# EAGLE design Mabee_CO2 v1.1 (EAGLE 6.1)
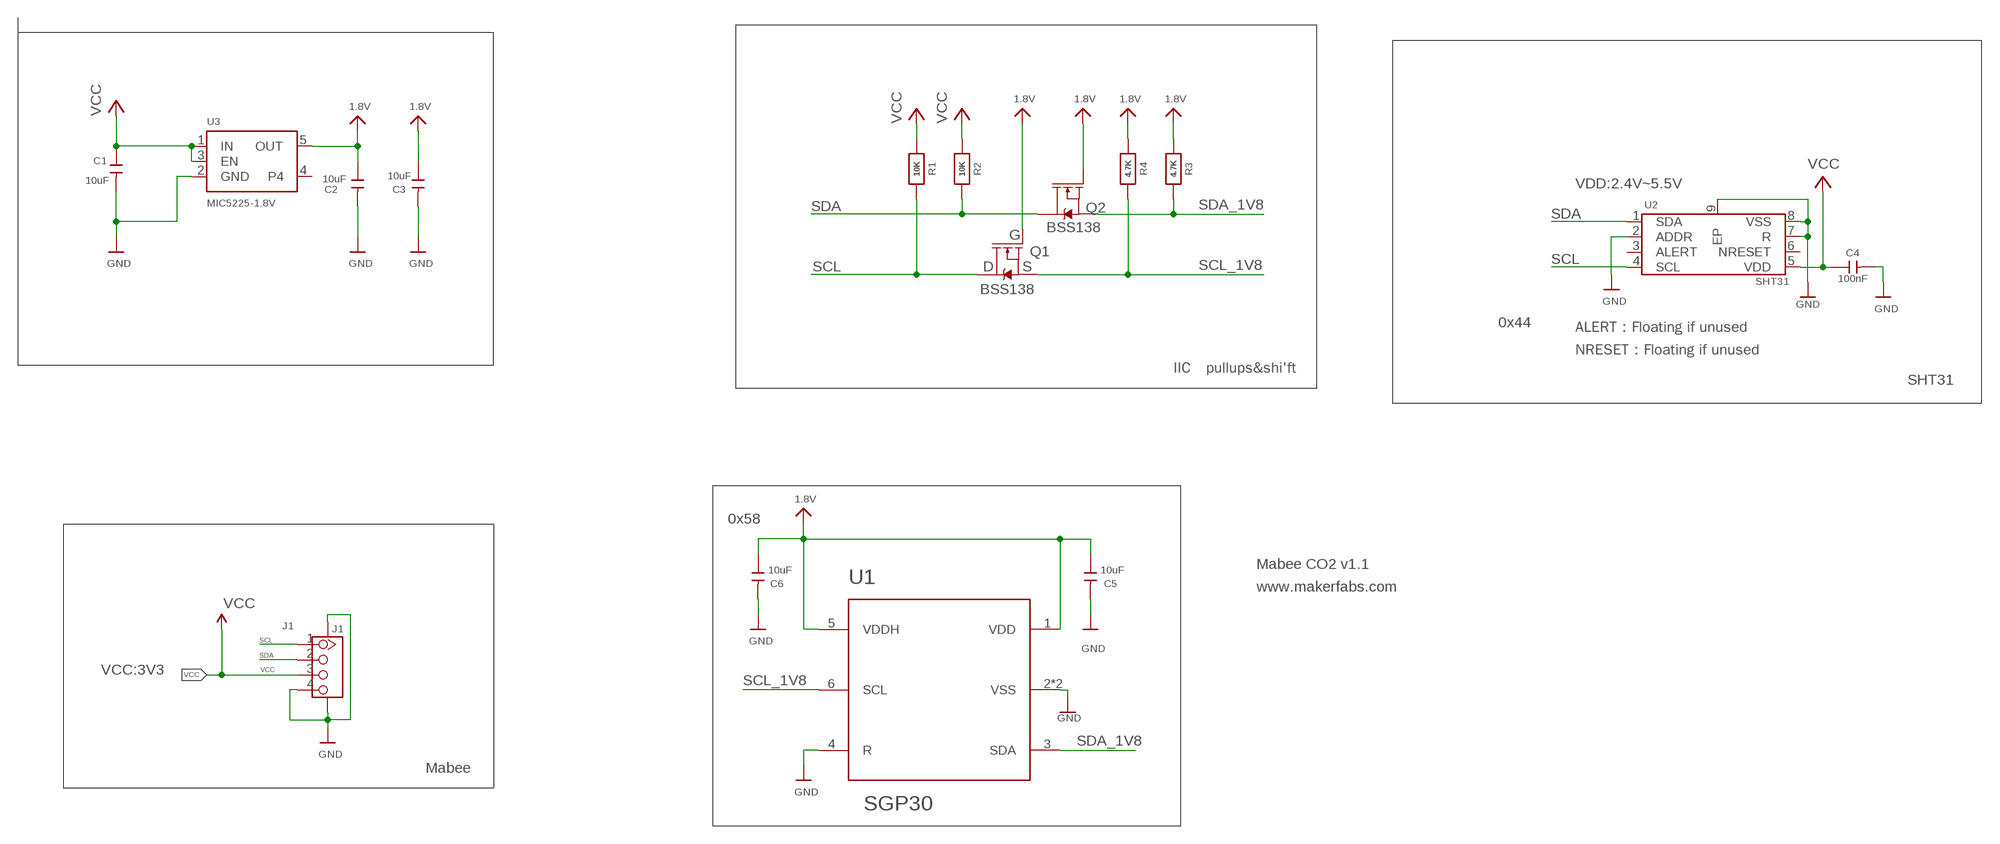
[diagram p0: schematic, sheet 1]

## Parts
C1  10uF  C-0603  [0603]
C2  10uF  C-0603  [0603]
C3  10uF  C-0603  [0603]
C4  100nF  C-0603  [0603]
C5  10uF  C-0603  [0603]
C6  10uF  C-0603  [0603]
J1  J1  GROVE-CONNECTOR-SMD'90D'  [HW4-SMD-2.0-90D]
Q1  BSS138  MOSFET-NCH-BSS138  [SOT23-3]
Q2  BSS138  MOSFET-NCH-BSS138  [SOT23-3]
R1  10K  RESISTOR_0603_NOOUT  [0603-NO]
R2  10K  RESISTOR_0603_NOOUT  [0603-NO]
R3  4.7K  RESISTOR_0603_NOOUT  [0603-NO]
R4  4.7K  RESISTOR_0603_NOOUT  [0603-NO]
U1  SGP30  [SGP30]
U2  SHT31  [DFN-8(3X3)_EP]
U3  MIC5225-1.8V  VREG_SOT23-5  [SOT23-5]

## Nets
1.8V: C2.1 C3.1 C5.1 C6.1 Q1.1(G) Q2.1(G) R3.1 R4.1 U1.1(VDD) U1.5(VDDH) U3.5(OUT)
GND: C1.2 C2.2 C3.2 C4.2 C5.2 C6.2 J1.4 J1.SS1 J1.SS2 U1.2(VSS) U1.4(R) U1.P$7(VSS) U2.2(ADDR) U2.7(R) U2.8(VSS) U2.9(EP) U3.2(GND)
SCL: J1.1 Q1.3(D) R1.2 U2.4(SCL)
SCL_1V8: Q1.2(S) R4.2 U1.6(SCL)
SDA: J1.2 Q2.3(D) R2.2 U2.1(SDA)
SDA_1V8: Q2.2(S) R3.2 U1.3(SDA)
VCC: C1.1 C4.1 J1.3 R1.1 R2.1 U2.5(VDD) U3.1(IN) U3.3(EN)
Unconnected: U2.3(ALERT) U2.6(NRESET) U3.4

## Notes on the sheet
- VDD:2.4V~5.5V
- G
- D | S
- 0x44
- ALERT：Floating if unused
- NRESET：Floating if unused
- IIC　pullups&shi'ft
- SHT31
- 0x58
- Mabee CO2 v1.1
- www.makerfabs.com
- VCC:3V3
- Mabee

## Library data of the parts
C1-C6 = Discrete:C*: Ceramic Capacitors
J1 = Connector-new:GROVE-CONNECTOR-SMD: 4P-SMD-2.0:320110030;4P-SMD-2.0-90D:320110032
Q1 Q2 = SparkFun-DiscreteSemi:MOSFET-NCH: N-channel MOSFETs Voltage controlled devices that allow control of high current outputs. SparkFun Products: SparkFun OpenScale <https://www.sparkfun.com/products/13261> SparkFun Digital Sandbox <https://www.sparkfun.com/products/12651> SparkFun Monster Moto Shield <https://www.sparkfun.com/products/10182> SparkFun MOSFET Power Controller <https://www.sparkfun.com/products/11214>; PROD_ID: TRANS-00830; VALUE: 220mA/50V/3.5Ω
R1-R4 = microbuilder:RESISTOR: Resistors For new designs, use the packages preceded by an '_' character since they are more reliable: The following footprints should be used on most boards: _0402 - Standard footprint for regular board layouts _0603 - Standard footprint for regular board layouts _0805 - Standard footprint for regular board layouts _1206 - Standard footprint for regular board layouts For extremely tight-pitch boards where space is at a premium, the following 'micro-pitch' footprints can be used (smaller pads, no silkscreen outline, etc.): _0402MP - Micro-pitch footprint for very dense/compact boards _0603MP - Micro-pitch footprint for very dense/compact boards _0805MP - Micro-pitch footprint for very dense/compact boards _1206MP - Micro-pitch footprint for very dense/compact boards
U1 = SGP30 Rev D:SGP30: Sensirion SGP30 multi-pixel gas sensor
U2 = SGP30 Rev D:SHT31
U3 = microbuilder:VREG_SOT23-5: SOT23-5 Fixed Voltage Regulators Part Current Out V Out V In V Dropout θJA (°C/W) TJ (°C) Digikey Part No. ADP121 150mA 3.3V 3.4-5.5V 0.09V @ 150mA -- -- ADP121-AUJZ33R7CT-ND ADP121 150mA 3.0V 3.1-5.5V 0.09V @ 150mA -- -- ADP121-AUJZ30R7CT-ND ADP122 300mA 3.3V 3.4-5.5V 0.085V @ 300mA -- -- ADP122AUJZ-3.3-R7CT-ND ADP1712 300mA 3.3V 3.5-5.5V 0.17V @ 300mA -- -- ADP1712AUJZ-3.3-R7TR-ND AP7311 (Low Cost) 150mA 3.3V 3.5-6V 0.15V @ 150mA -- -- AP7311-33WG-7DICT-ND LD39015M18R 150mA 1.8V 1.9V-5.5V 0.08V @ 100mA -- -- 497-6977-1-ND LP2985A-33DBVR 150mA 3.3V 3.3-16V 0.28V @ 150mA 206 150 296-18479-1-ND MCP1824T-3302E/OT 300mA 3.3V 3.5V-6V 0.2V @ 300mA -- -- MCP1824T-3302E/OTCT-ND MIC5205-2.5YM5 TR 150mA 2.5V 2.7-16V 0.165V @ 150mA -- -- 576-1257-2-ND MIC5205-3.0YM5 TR 150mA 3.0V 3.2V-16V 0.165V @ 150mA -- -- 576-1258-2-ND MIC5205-3.3YM5 TR 150mA 3.3V 3.5V-16V 0.165V @ 150mA -- -- 576-1259-2-ND TPS780330220 150mA 3.3V+2.2V 3.6-5.5V 250mV Max -- -- 296-23332-1-ND TDA3663/N1,135 100mA 3.3V 3.5-45V 0.18V @ 50mA -- -- 568-5343-1-ND Max operating temp can be calculated using θJA, TJ (max junction temperature), and power in watts. Set the "Maximum Ambient Temperature" until it reaches TJ ("Max Junction Temperature"), which is the absolute limit for safe use of the regulator: Heat Sink Temperature Calculator <http://www.daycounter.com/Calculators/Heat-Sink-Temperature-Calculator.phtml> For example, With 12V source into a 3.3V LP2985 and a 30mA load, we are dissipating (12V-3.3V) * 0.03A = 0.261W. With a θJA of 206 °C/W, a TJ of 150°C, and 261mW we can safely use the chip without a heat sink up to 75°C (=147.1°C Junction Temperature).

## Net classes
0 default: width 0.152 mm, drill 0.305 mm, clearance 0.152 mm
1 highpower: width 0.305 mm, drill 0.483 mm
2 lowpower: width 0.254 mm, drill 0.483 mm

## Board
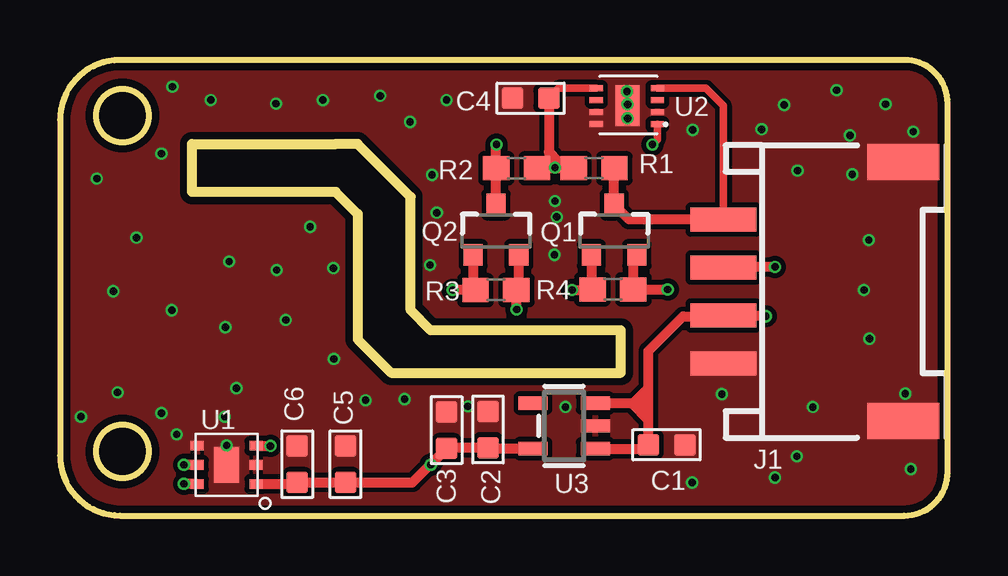
[diagram p1: board, top side]
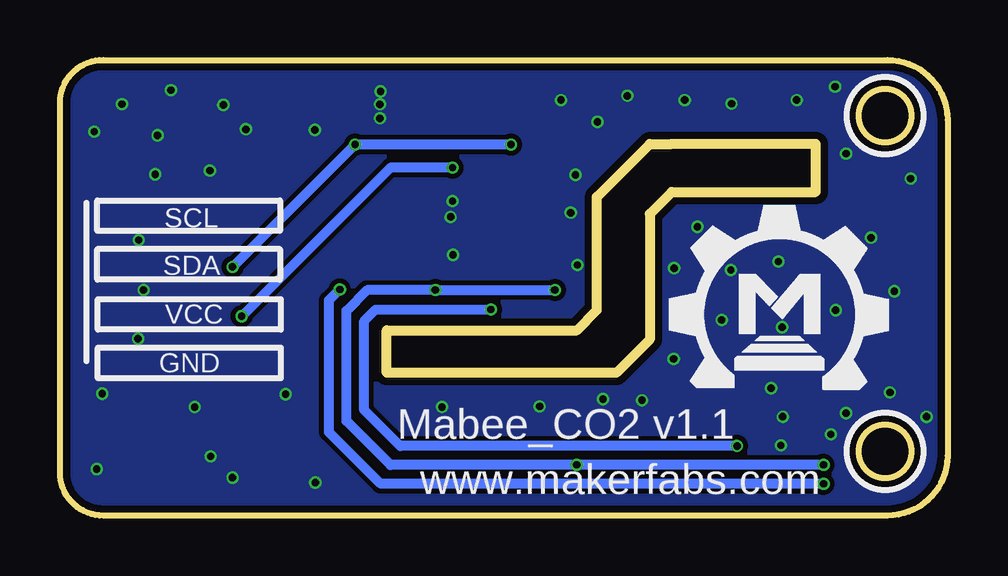
[diagram p2: board, bottom side, seen from below]

Size 37 x 19 mm. Coordinates in mm from the lower left corner, seen from the top.
Outline: 11.5,15.5 5.5,15.5 5.5,13.5 11.5,13.5
Outline: 11.49,13.49 12.41,12.58 12.41,7.35 13.8,5.95 23.38,5.95 23.38,7.73 15.46,7.73 14.62,8.57 14.62,13.29 12.41,15.5 11.52,15.5
Outline: 2.5,0 35.2,0 arc90 37,1.8 37,17.2 arc90 35.2,19 2.5,19 arc90 0,16.5 0,2.5 arc90 2.5,0
Outline: circle at 2.6,16.68 radius 1.1
Outline: circle at 2.6,2.67 radius 1.1
Copper layers (1*16): Top 0.035mm / dielectric 1.5mm / Bottom 0.035mm
Design rules: minimum track width 10mil, minimum drill 10mil, track to track 8mil, track to pad 8mil, pad to pad 8mil, via to via 8mil, smd to smd 0mil, copper to edge 12mil, drill to drill 8mil, minimum pad ring 10mil, minimum via ring 4mil, stop-mask expansion 2mil, vias tented up to drill 100mil, thermal gap 0mil

### Footprints (pad centres in the part's own frame; a part is rotated, then mirrored left to right if it is on the bottom)
0603 = smd 0.889 x 0.889: 1 -0.762,0; 2 0.762,0
HW4-SMD-2.0-90D = smd 1.01 x 2.74: 1 -3,-0.1; 2 -1,-0.1; 3 1,-0.1; 4 3,-0.1 | smd 1.5 x 3: SS1 -5.4,7.4; SS2 5.4,7.4
SOT23-3 = smd 0.8 x 0.9: 1 -0.95,-1; 2 0.95,-1; 3 0,1.1
0603-NO = smd 1.1 x 1: 1 -0.85,0; 2 0.85,0
SGP30 = smd 0.55 x 0.4: 1 -1.225,0.8; 2 -1.225,0; 3 -1.225,-0.8; 4 1.225,-0.8; 5 1.225,0; 6 1.225,0.8 | smd 1.05 x 1.5: P$7 0,0
DFN-8(3X3)_EP = smd 0.55 x 0.25: 1 0,0; 2 0,-0.5; 3 0,-1; 4 0,-1.5; 5 2.55,-1.5; 6 2.55,-1; 7 2.55,-0.5; 8 2.55,0 | smd 1 x 1.7: 9 1.25,-0.785
SOT23-5 = smd 0.55 x 1.2: 1 -0.95,-1.3; 2 0,-1.3; 3 0.95,-1.3; 4 0.95,1.3; 5 -0.95,1.3

### Placement (x,y rotation side)
C1  25.29,2.95 0 top
C2  17.84,3.59 90 top
C3  16.12,3.56 90 top
C4  19.62,17.4 180 top
C5  11.9,2.14 90 top
C6  9.89,2.14 90 top
J1  27.76,9.35 270 top
Q1  23.1,11.87 0 top
Q2  18.17,11.87 0 top
R1  22.26,14.48 0 top
R2  19.04,14.48 180 top
R3  18.17,9.4 0 top
R4  23.05,9.43 0 top
U1  6.95,2.11 180 top
U2  24.9,16.31 180 top
U3  21.02,3.74 90 top
U$10  [MAKERFABS_0.3]  11.13,5.31 0 bottom

### Tracks (layer width: path | path; a pad name or v marks a point on that pad's centre or on a via)
1.8V  (via drill 0.3)
  Top 0.406: Q1.1 22.15,9.48 R4.1 22.18,9.4 v21.35,9.4 | Q2.1 17.22,9.5 R3.1 v16.37,9.4 | U3.5 17.88,2.79 C2.1 16.14,2.83 C3.1 | C3.1 14.69,1.38 C5.1 C6.1 9.83,1.31 U1.1 | U1.5 v5.17,2.11 | C3.1 16.12,2.77 v15.46,2.11
  Bottom 0.406: v5.17,2.11 v15.46,2.11 23.23,2.11 25.06,3.94 25.06,8.54 24.19,9.4 v21.35,9.4 | 21.37,9.43 v21.35,9.4 | v21.35,9.4 v16.37,9.4
GND  (via drill 0.3)
  other vias: 6.9,7.85 9.03,10.24 3.19,11.59 11.39,10.32 1.54,14.05 6.29,17.33 10.96,17.33 14.59,16.41 15.51,14.2 30.19,17.13 30.75,14.38 35.57,16.01 33.03,14.23 35.47,1.94 35.24,5.09 31.38,4.53 29.81,1.58 26.35,1.38 27.6,5.06 33.52,9.4 33.72,11.49 33.74,7.37 20.71,12.45 20.64,13.11 15.71,12.63 15.43,10.45 16.12,17.33 23.63,17.68 23.66,17.15 32.37,17.74 32.93,15.86 34.42,17.16 4.69,17.89 4.23,15.09 2.22,9.35 7.05,10.6 11.42,6.53 0.88,4.12 4.23,4.27 4.86,3.38 2.4,5.14 7.35,5.31 6.87,4.12 6.95,2.93 12.74,4.81 14.36,4.86 9.41,8.16 10.43,12.05 4.66,8.57 26.38,16.08 23.66,16.57 13.35,17.51 9,17.18 20.61,10.88 29.25,16.11 30.72,2.47 21.07,4.53 17.01,4.55
  pour Bottom: 41.95,23.07 -10.17,22.74 -10.43,-2.41 42.2,-2.08
  pour Top: -9.23,23.3 -9.44,-2.94 41.57,-2.94 41.26,23.3
SCL
  Top 0.305: U2.4 26.93,17.81 27.65,17.1 27.65,12.36 J1.1
  Top 0.406: J1.1 23.72,12.35 Q1.3 R1.2
SCL_1V8  (via drill 0.3)
  Top 0.406: Q1.2 23.9,10.72 R4.2 v25.34,9.43 | U1.6 5.18,1.31 v5.17,1.33
  Bottom 0.406: v5.17,1.33 23.64,1.33 25.79,3.49 25.79,8.97 v25.34,9.43
SDA  (via drill 0.3)
  Top 0.305: U2.1 24.91,15.68 v24.7,15.47
  Top 0.406: Q2.3 18.17,14.47 R2.2 18.19,15.46 v18.2,15.47 | J1.2 27.68,10.37 v29.81,10.37
  Bottom 0.406: v18.2,15.47 v24.7,15.47 v29.81,10.37
SDA_1V8  (via drill 0.3)
  Top 0.406: Q2.2 19.12,9.5 R3.2 19.04,9.39 v19.04,8.59 | U1.3 8.76,2.91 v8.78,2.9
  Bottom 0.406: v8.78,2.9 22.82,2.9 24.32,4.4 24.32,8.11 23.84,8.59 v19.04,8.59
VCC  (via drill 0.3)
  Top 0.305: U2.5 20.79,17.81 C4.1
  Top 0.406: R2.1 20.43,14.48 | 20.43,14.48 R1.1 | C4.1 20.38,15.17 | 20.38,15.17 20.38,14.54 20.43,14.48 | U3.1 24.36,2.79 C1.1 24.52,4.55 | U3.3 24.39,4.69 24.52,4.55 | 24.52,4.55 24.52,5.31 | 24.52,5.31 24.52,6.86 25.97,8.31 27.62,8.31 J1.3 29.39,8.35 v29.43,8.31 | 24.5,4.02 23.86,4.65 24.52,5.31 | 20.38,15.17 20.77,14.79 20.94,14.79 20.69,14.54 20.64,14.54 v20.64,14.51
  Bottom 0.406: v20.64,14.51 23.23,14.51 v29.43,8.31

### Text on the board
bPlace: Mabee_CO2 v1.1 | www.makerfabs.com
bNames: SCL | SDA | VCC | GND